# Altium schematic sheet PEDALBOX_BULKHEAD.SchDoc: =DocumentName
size A4; Organization: Queen's Formula SAE; Address1: 130 Stuart St, Kingston; Address2: Ontario; Address3: Canada; Address4: K7L 2V9; DocumentNumber: 1; Revision: 0; SheetNumber: 1; SheetTotal: 1
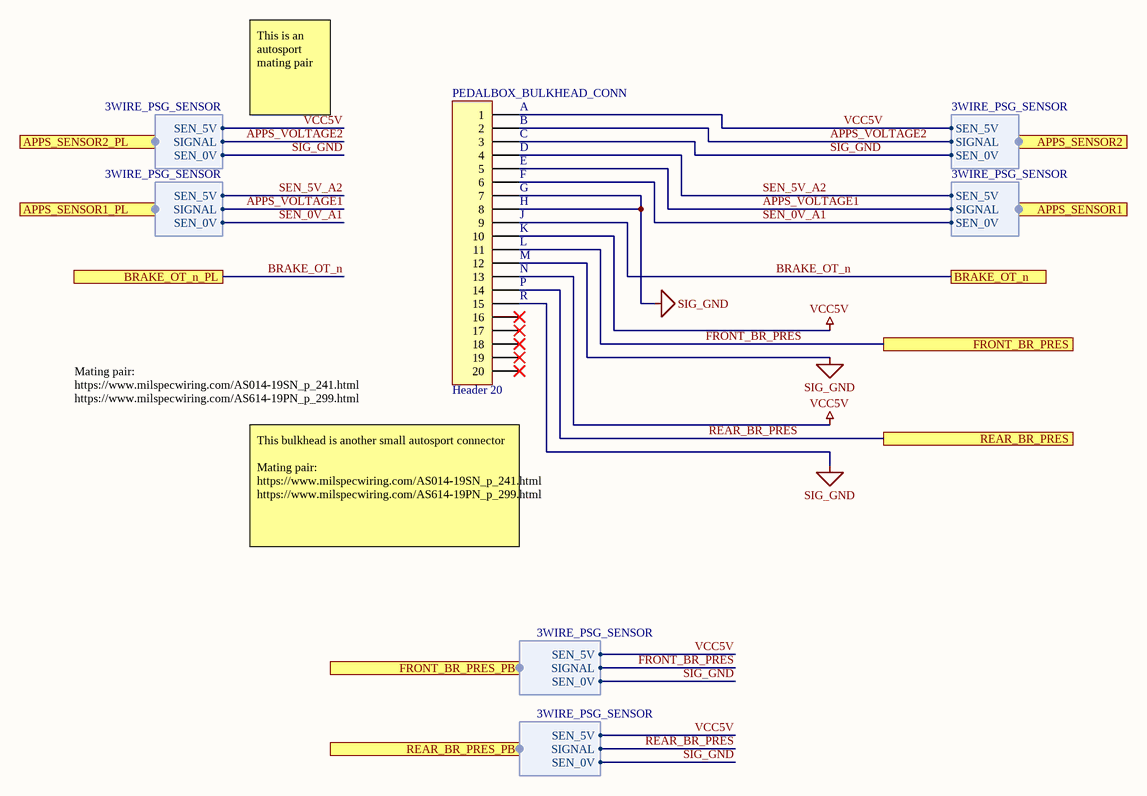
[diagram p0: PEDALBOX_BULKHEAD.SchDoc]

## Parts
PEDALBOX_BULKHEAD_CONN  Header 20  [HDR1X20]

## Ports
APPS_SENSOR1 (harness 3WIRE_PSG_SENSOR), APPS_SENSOR1_PL (harness 3WIRE_PSG_SENSOR), APPS_SENSOR2 (harness 3WIRE_PSG_SENSOR), APPS_SENSOR2_PL (harness 3WIRE_PSG_SENSOR), BRAKE_OT_n, BRAKE_OT_n_PL, FRONT_BR_PRES, FRONT_BR_PRES_PB (harness 3WIRE_PSG_SENSOR), REAR_BR_PRES, REAR_BR_PRES_PB (harness 3WIRE_PSG_SENSOR)

## Harnesses
3WIRE_PSG_SENSOR: SEN_5V, SEN_0V, SIGNAL

## Nets
SIG_GND: PEDALBOX_BULKHEAD_CONN.3 PEDALBOX_BULKHEAD_CONN.7 PEDALBOX_BULKHEAD_CONN.8 PEDALBOX_BULKHEAD_CONN.12 PEDALBOX_BULKHEAD_CONN.15 ; port APPS_SENSOR2.SEN_0V, port APPS_SENSOR2_PL.SEN_0V, port FRONT_BR_PRES_PB.SEN_0V, port REAR_BR_PRES_PB.SEN_0V
VCC5V: PEDALBOX_BULKHEAD_CONN.1 PEDALBOX_BULKHEAD_CONN.10 PEDALBOX_BULKHEAD_CONN.13 ; port APPS_SENSOR2.SEN_5V, port APPS_SENSOR2_PL.SEN_5V, port FRONT_BR_PRES_PB.SEN_5V, port REAR_BR_PRES_PB.SEN_5V
APPS_VOLTAGE1: PEDALBOX_BULKHEAD_CONN.5 ; port APPS_SENSOR1.SIGNAL, port APPS_SENSOR1_PL.SIGNAL
APPS_VOLTAGE2: PEDALBOX_BULKHEAD_CONN.2 ; port APPS_SENSOR2.SIGNAL, port APPS_SENSOR2_PL.SIGNAL
BRAKE_OT_n: PEDALBOX_BULKHEAD_CONN.9 ; port BRAKE_OT_n, port BRAKE_OT_n_PL
FRONT_BR_PRES: PEDALBOX_BULKHEAD_CONN.11 ; port FRONT_BR_PRES, port FRONT_BR_PRES_PB.SIGNAL
REAR_BR_PRES: PEDALBOX_BULKHEAD_CONN.14 ; port REAR_BR_PRES, port REAR_BR_PRES_PB.SIGNAL
SEN_0V_A1: PEDALBOX_BULKHEAD_CONN.6 ; port APPS_SENSOR1.SEN_0V, port APPS_SENSOR1_PL.SEN_0V
SEN_5V_A2: PEDALBOX_BULKHEAD_CONN.4 ; port APPS_SENSOR1.SEN_5V, port APPS_SENSOR1_PL.SEN_5V

Not connected (* = marked no-connect by the designer): PEDALBOX_BULKHEAD_CONN 16* 17* 18* 19* 20*

## Notes on the sheet
- This is an autosport mating pair
- (near PEDALBOX_BULKHEAD_CONN) A
- (near PEDALBOX_BULKHEAD_CONN) B
- (near PEDALBOX_BULKHEAD_CONN) C
- (near PEDALBOX_BULKHEAD_CONN) D
- (near PEDALBOX_BULKHEAD_CONN) E
- (near PEDALBOX_BULKHEAD_CONN) F
- (near PEDALBOX_BULKHEAD_CONN) G
- (near PEDALBOX_BULKHEAD_CONN) H
- (near PEDALBOX_BULKHEAD_CONN) J
- (near PEDALBOX_BULKHEAD_CONN) K
- (near PEDALBOX_BULKHEAD_CONN) L
- (near PEDALBOX_BULKHEAD_CONN) M
- (near PEDALBOX_BULKHEAD_CONN) N
- (near PEDALBOX_BULKHEAD_CONN) P
- (near PEDALBOX_BULKHEAD_CONN) R
- Mating pair:
  https://www.milspecwiring.com/AS014-19SN_p_241.html
  https://www.milspecwiring.com/AS614-19PN_p_299.html
- This bulkhead is another small autosport connector
  Mating pair:
  https://www.milspecwiring.com/AS014-19SN_p_241.html
  https://www.milspecwiring.com/AS614-19PN_p_299.html
- Title
- Size:
- Date:
- A4
- Number:
- Time:
- Revision:
- Sheet
- of
- File:

## Library data of the parts
PEDALBOX_BULKHEAD_CONN = Header 20: Header, 20-Pin; LatestRevisionDate: 17-Jul-2002; LatestRevisionNote: Re-released for DXP Platform.; Publisher: Altium Limited